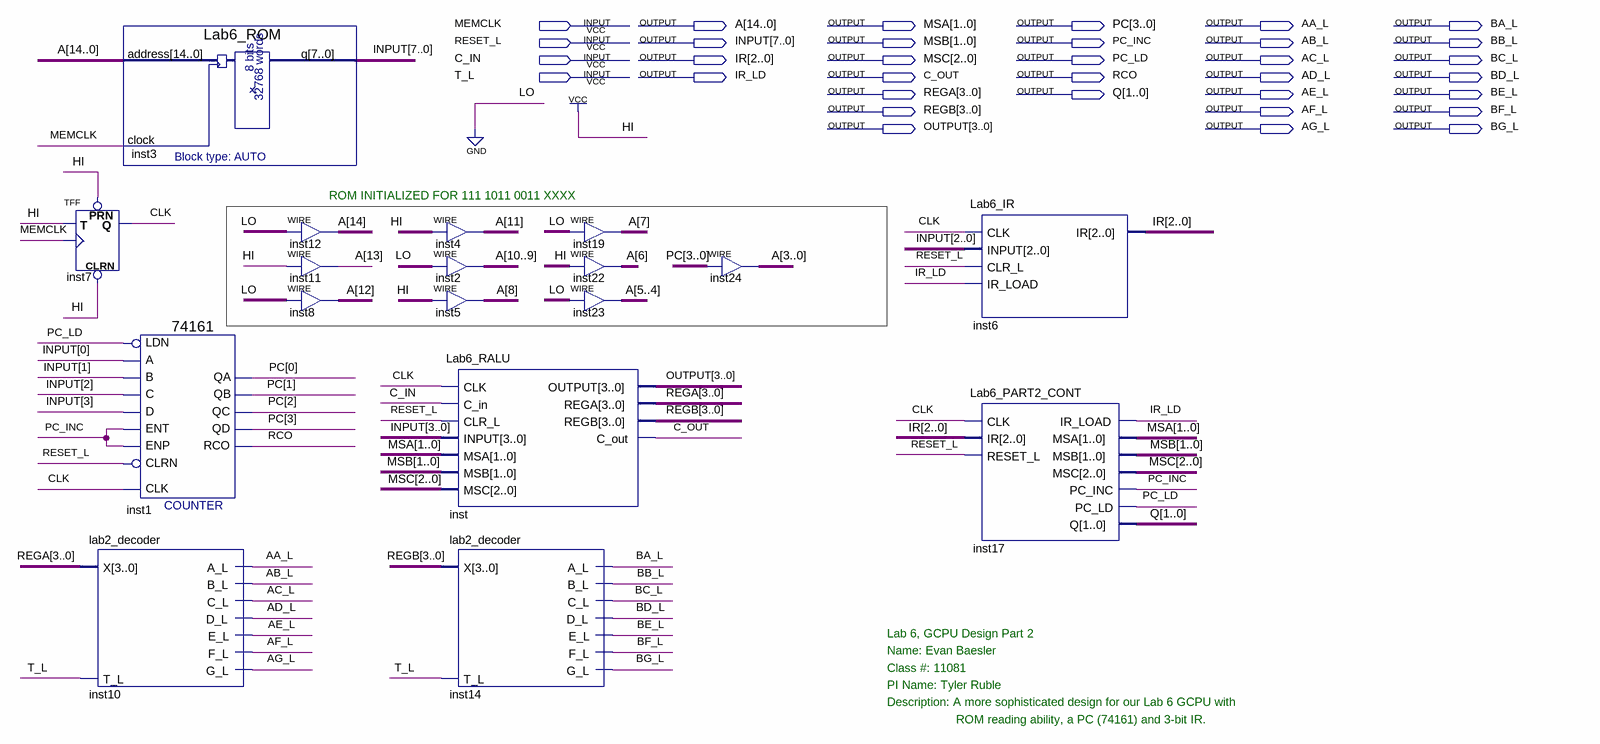
[diagram p0: schematic sheet]
// Quartus schematic Lab6_PART2.bdf as structural Verilog: 18 symbols, 34 pins
module Lab6_PART2 (
  input  MEMCLK,
  input  RESET_L,
  input  C_IN,
  input  T_L,
  output [14:0] A,
  output [1:0] MSA,
  output [3:0] PC,
  output AA_L,
  output BA_L,
  output [7:0] INPUT,
  output [1:0] MSB,
  output PC_INC,
  output AB_L,
  output BB_L,
  output [2:0] IR,
  output [2:0] MSC,
  output PC_LD,
  output AC_L,
  output BC_L,
  output IR_LD,
  output C_OUT,
  output RCO,
  output AD_L,
  output BD_L,
  output [3:0] REGA,
  output [1:0] Q,
  output AE_L,
  output BE_L,
  output [3:0] REGB,
  output AF_L,
  output BF_L,
  output [3:0] OUTPUT,
  output AG_L,
  output BG_L
);

  wire CLK;

  TFF inst7 (.PRN(1'b1), .CLRN(1'b1), .T(1'b1), .CLK(MEMCLK), .Q(CLK));
  Lab6_ROM inst3 (.address(A), .clock(MEMCLK), .q(INPUT));
  \74161  inst1 (
    .CLRN(RESET_L), .CLK(CLK), .ENP(PC_INC), .LDN(PC_LD), .A(INPUT[0]), .D(INPUT[3]), .ENT(PC_INC),
    .B(INPUT[1]), .C(INPUT[2]), .QD(PC[3]), .QC(PC[2]), .QB(PC[1]), .QA(PC[0]), .RCO(RCO));
  lab2_decoder inst10 (
    .X(REGA), .T_L(T_L), .C_L(AC_L), .D_L(AD_L), .A_L(AA_L), .E_L(AE_L), .B_L(AB_L), .F_L(AF_L), .G_L(AG_L));
  assign A[14] = 1'b0;  // WIRE inst12
  assign A[13] = 1'b1;  // WIRE inst11
  assign A[12] = 1'b0;  // WIRE inst8
  assign A[11] = 1'b1;  // WIRE inst4
  assign A[10:9] = 2'b00;  // WIRE inst2
  assign A[8] = 1'b1;  // WIRE inst5
  Lab6_RALU inst (
    .CLK(CLK), .C_in(C_IN), .CLR_L(RESET_L), .INPUT(INPUT[3:0]), .MSA(MSA), .MSB(MSB), .MSC(MSC),
    .OUTPUT(OUTPUT), .REGA(REGA), .REGB(REGB), .C_out(C_OUT));
  lab2_decoder inst14 (
    .X(REGB), .T_L(T_L), .C_L(BC_L), .D_L(BD_L), .A_L(BA_L), .E_L(BE_L), .B_L(BB_L), .F_L(BF_L), .G_L(BG_L));
  assign A[7] = 1'b0;  // WIRE inst19
  assign A[6] = 1'b1;  // WIRE inst22
  assign A[5:4] = 2'b00;  // WIRE inst23
  assign A[3:0] = PC;  // WIRE inst24
  Lab6_IR inst6 (.CLK(CLK), .INPUT(INPUT[2:0]), .CLR_L(RESET_L), .IR_LOAD(IR_LD), .IR(IR));
  Lab6_PART2_CONT inst17 (
    .CLK(CLK), .IR(IR), .RESET_L(RESET_L), .IR_LOAD(IR_LD), .MSA(MSA), .MSB(MSB), .MSC(MSC), .PC_INC(PC_INC),
    .PC_LD(PC_LD), .Q(Q));

  // Notes on the sheet:
  //   ROM INITIALIZED FOR 111 1011 0011 XXXX
  //   Lab 6, GCPU Design Part 2
  //   Name: Evan Baesler
  //   Class #: 11081
  //   PI Name: Tyler Ruble
  //   Description: A more sophisticated design for our Lab 6 GCPU with
  //   ROM reading ability, a PC (74161) and 3-bit IR.
endmodule
